# Altium schematic sheet Schemathic_IV-11_Clock.SchDoc
size A3; SheetNumber: 1; SheetTotal: 1; SPICEModelCacheXETPOSJP: <root> / <DocumentId>XETPOSJP</DocumentId> / </root>
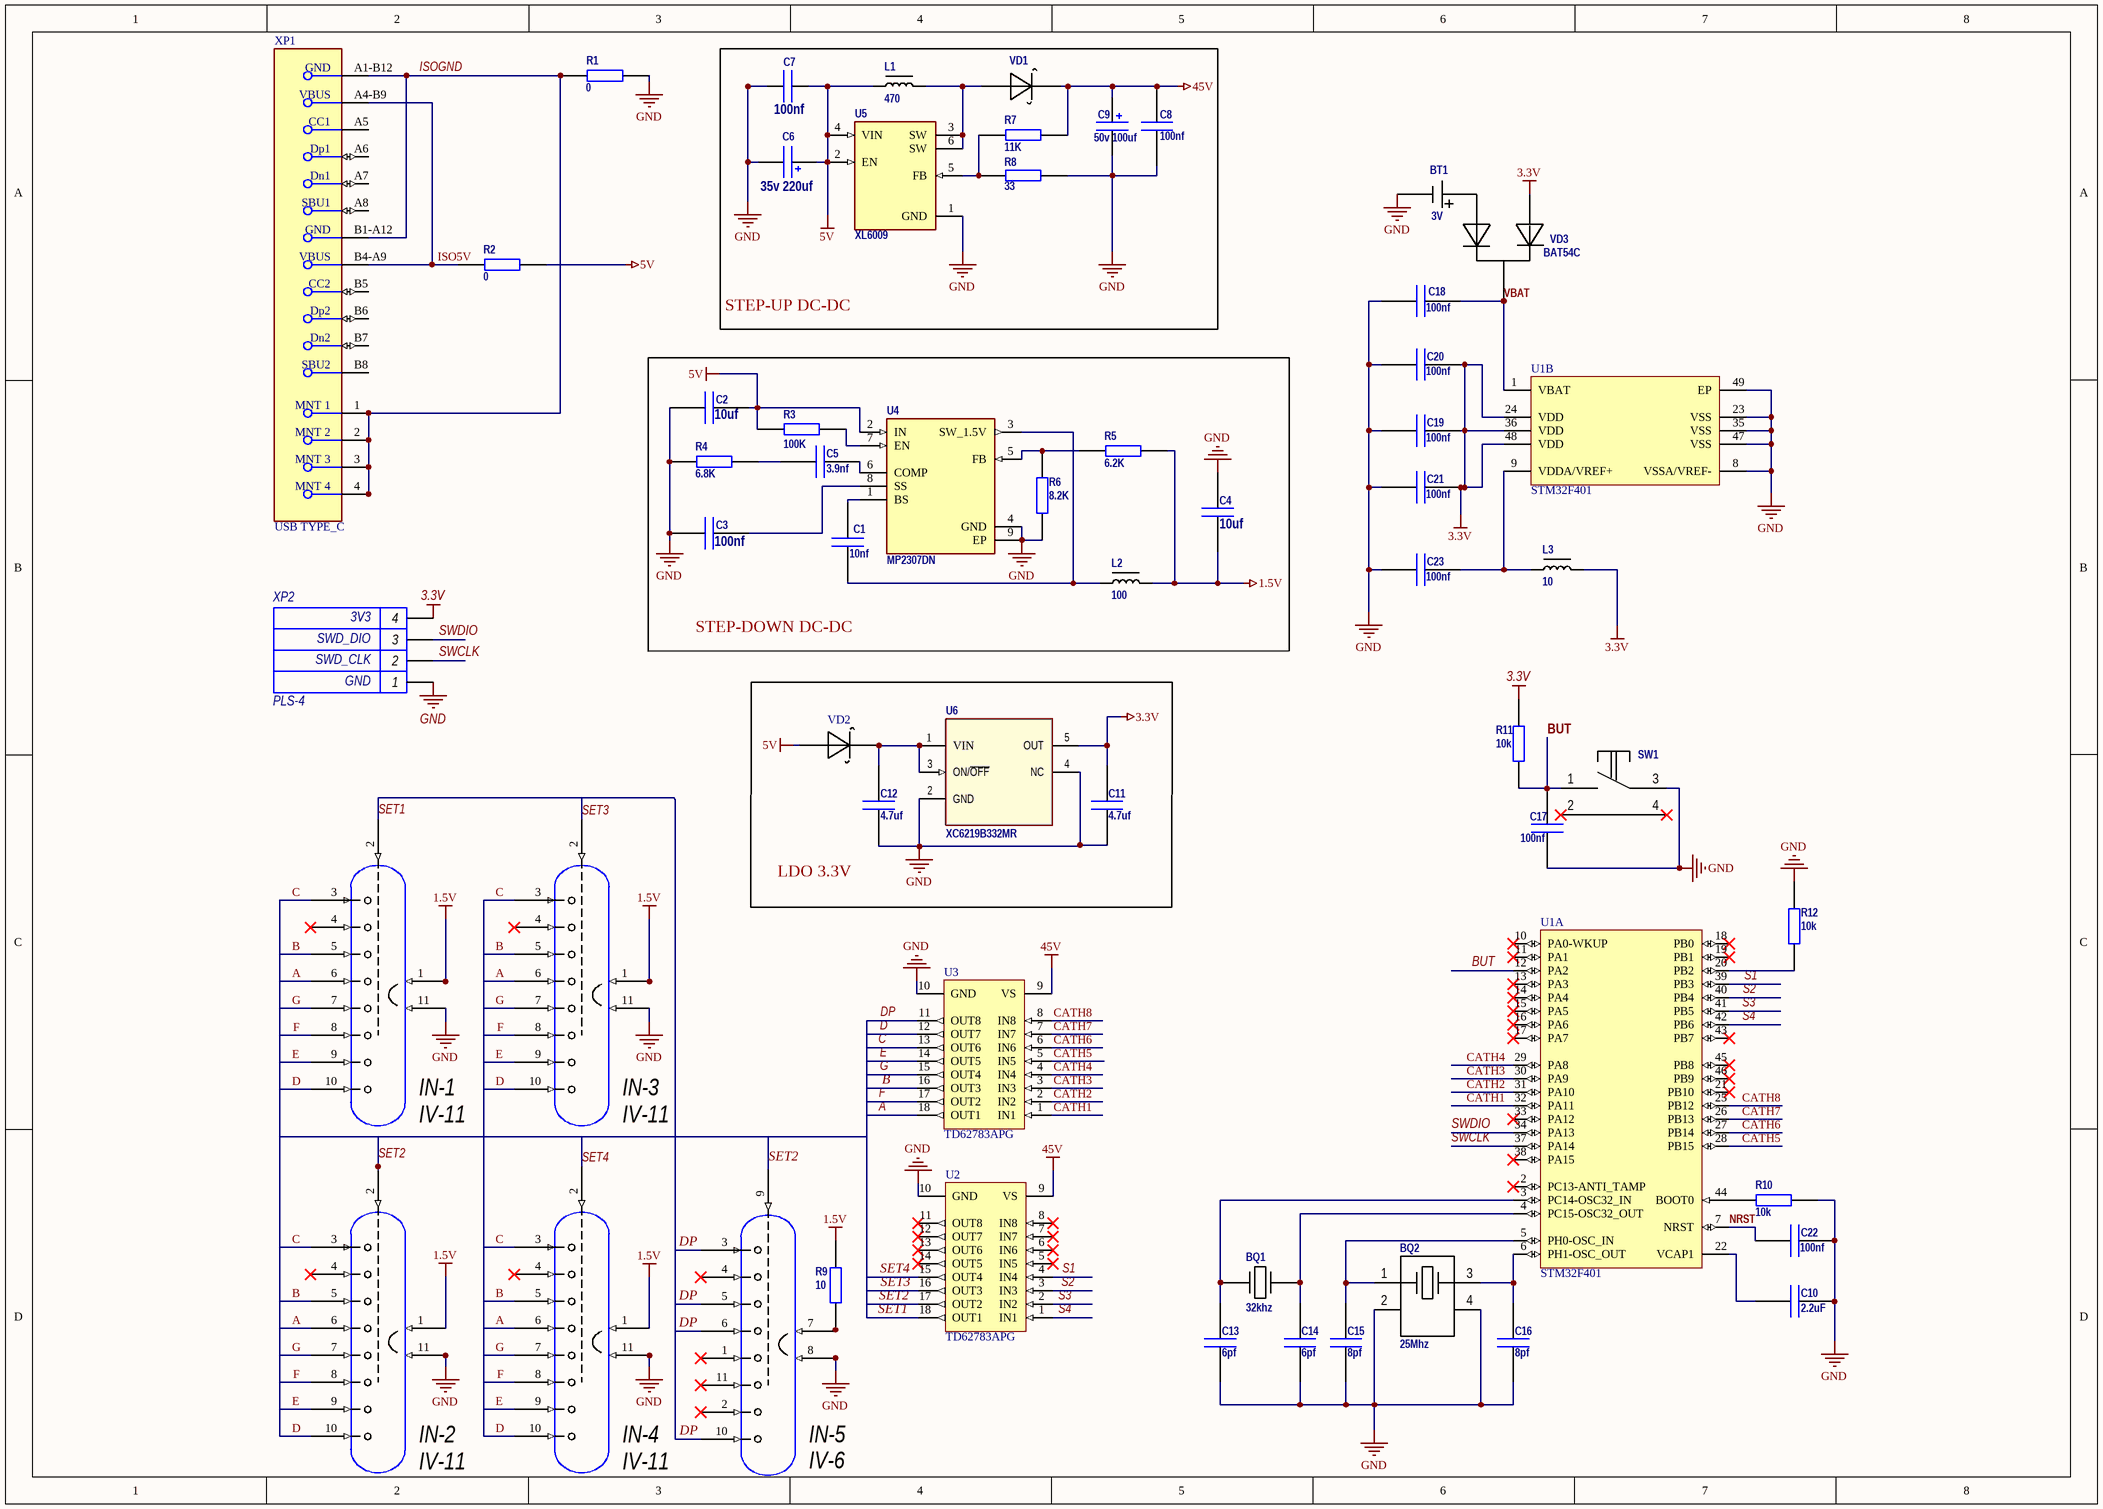
[diagram p0: Schemathic_IV-11_Clock.SchDoc]

## Parts
BQ1  32khz  [KX-327NHT]
BQ2  25Mhz  [4-SMD No lead]
BT1  value 3V  [Battery_2032]  (hidden comment: CR2032)
C1  10nf  [Cap_0603]
C2  10uf  [Cap_1206_3216]
C3  100nf  [Cap_0603]
C4  10uf  [Cap_1206_3216]
C5  3.9nf  [Cap_0603]
C6  35v 220uf  [CAP 6.6MM H5.4MM]
C7  100nf  [Cap_0603]
C8  100nf  [Cap_0603]
C9  value 50v 100uf  [CAP 6.6MM H5.4MM]  (hidden comment: 100uf)
C10  2.2uF  [Cap_0402]
C11  4.7uf  [Cap_0402]
C12  4.7uf  [Cap_0402]
C13  6pf  [Cap_0402]
C14  6pf  [Cap_0402]
C15  8pf  [Cap_0402]
C16  8pf  [Cap_0402]
C17  100nf  [Cap_0402]
C18  100nf  [Cap_0402]
C19  100nf  [Cap_0402]
C20  100nf  [Cap_0402]
C21  100nf  [Cap_0402]
C22  100nf  [Cap_0402]
C23  100nf  [Cap_0402]
IN-1  IV-11  [PCBComponent_1]
IN-2  IV-11  [PCBComponent_1]
IN-3  IV-11  [PCBComponent_1]
IN-4  IV-11  [PCBComponent_1]
IN-5  IV-6  [PCBComponent_1]
L1  470  [CDRH127NP]
L2  100  [3232_8.89 mm]
L3  10  [FER 0603]
R1  0  [Res_1206]
R2  0  [Res_1206]
R3  100K  [RES_0603]
R4  6.8K  [RES_0603]
R5  value 6.2K  [RES_0603]  (hidden comment: 5.1K)
R6  8.2K  [RES_0603]
R7  11K  [RES_0603]
R8  33  [RES_0603]
R9  10  [DIP]
R10  10k  [Res_0201]
R11  10K  [Res_0201]
R12  10k  [Res_0201]
SW1  Switch Right Angle  [Button Right Angle]  (value not drawn)
U1  STM32F401  [STM-UFQFPN48_N]  (parts A,B of 2)
U2  TD62783APG  [ALEG-DIP-18]
U3  TD62783APG  [ALEG-DIP-18]
U4  MP2307DN  [SOIC127P600X170-9N]
U5  XL6009  [DPAK170P1435X465-6N]
U6  XC6219B332MR  [SOT-23-5]
VD1  SS34  [SMA_DO214AC]  (value not drawn)
VD2  BAS321  [SOD323]  (value not drawn)
VD3  BAT54C  [SOT-23-3]
XP1  USB TYPE_C  [FP-USB4105-GF-A-MFG]
XP2  PLS-4  [PLS-4]

## Blocks framed on the sheet
STEP-UP DC-DC: C6-C9 L1 R7 R8 U5 VD1
STEP-DOWN DC-DC: C1-C5 L2 R3-R6 U4
LDO 3.3V: C11 C12 U6 VD2

## Nets
1.5V: C4.2 IN-1.1 IN-2.1 IN-3.1 IN-4.1 L2.2 R5.1 R9.2
3.3V: C11.1 C19.1 C20.1 C21.2 L3.1 R11.2 U1.24(VDD) U1.36(VDD) U1.48(VDD) U6.5(OUT) VD3.1 XP2.4
5V: C2.1 C6.1 C7.1 L1.1 R2.2 R3.2 U4.2(IN) U5.2(EN) U5.4(VIN) VD2.1
45V: C8.1 C9.1 R7.2 U2.9(VS) U3.9(VS) VD1.2
GND: BQ2.2(GND) BQ2.4(GND) BT1.2(-) C2.2 C3.1 C4.1 C6.2 C7.2 C8.2 C9.2 C10.2 C11.2 C12.2 C13.1 C14.1 C15.1 C16.1 C17.1 C18.1 C19.2 C20.2 C21.1 C22.2 C23.2 IN-1.11 IN-2.11 IN-3.11 IN-4.11 IN-5.8 R1.2 R4.2 R6.2 R8.2 R10.1 R12.2 SW1.3 U1.8(VSSA/VREF-) U1.23(VSS) U1.35(VSS) U1.47(VSS) U1.49(EP) U2.10(GND) U3.10(GND) U4.4(GND) U4.9(EP) U5.1(GND) U6.2(GND) U6.4(NC) XP2.1
A: IN-1.6 IN-2.6 IN-3.6 IN-4.6 U3.18(OUT1)
B: IN-1.5 IN-2.5 IN-3.5 IN-4.5 U3.16(OUT3)
BUT: C17.2 R11.1 SW1.1 U1.12(PA2)
C: IN-1.3 IN-2.3 IN-3.3 IN-4.3 U3.13(OUT6)
CATH1: U1.32(PA11) U3.1(IN1)
CATH2: U1.31(PA10) U3.2(IN2)
CATH3: U1.30(PA9) U3.3(IN3)
CATH4: U1.29(PA8) U3.4(IN4)
CATH5: U1.28(PB15) U3.5(IN5)
CATH6: U1.27(PB14) U3.6(IN6)
CATH7: U1.26(PB13) U3.7(IN7)
CATH8: U1.25(PB12) U3.8(IN8)
D: IN-1.10 IN-2.10 IN-3.10 IN-4.10 U3.12(OUT7)
DP: IN-5.3 IN-5.5 IN-5.6 IN-5.10 U3.11(OUT8)
E: IN-1.9 IN-2.9 IN-3.9 IN-4.9 U3.14(OUT5)
F: IN-1.8 IN-2.8 IN-3.8 IN-4.8 U3.17(OUT2)
G: IN-1.7 IN-2.7 IN-3.7 IN-4.7 U3.15(OUT4)
ISO5V: R2.1 XP1.A4-B9(VBUS) XP1.B4-A9(VBUS)
ISOGND: R1.1 XP1.1(MNT_1) XP1.2(MNT_2) XP1.3(MNT_3) XP1.4(MNT_4) XP1.A1-B12(GND) XP1.B1-A12(GND)
NRST: C22.1 U1.7(NRST)
S1: U1.39(PB3) U2.4(IN4)
S2: U1.40(PB4) U2.3(IN3)
S3: U1.41(PB5) U2.2(IN2)
S4: U1.42(PB6) U2.1(IN1)
SET1: IN-1.2 U2.18(OUT1)
SET2: IN-2.2 IN-5.9 U2.17(OUT2)
SET3: IN-3.2 U2.16(OUT3)
SET4: IN-4.2 U2.15(OUT4)
SWCLK: U1.37(PA14) XP2.2
SWDIO: U1.34(PA13) XP2.3
VBAT: C18.2 U1.1(VBAT) VD3.3
NetBQ1_1: BQ1.1(OSC1) C13.2 U1.3(PC14-OSC32_IN)
NetBQ1_2: BQ1.2(OSC2) C14.2 U1.4(PC15-OSC32_OUT)
NetBQ2_1: BQ2.1(OSC1) C15.2 U1.5(PH0-OSC_IN)
NetBQ2_3: BQ2.3(OSC2) C16.2 U1.6(PH1-OSC_OUT)
NetBT1_1: BT1.1(+) VD3.2
NetC1_1: C1.1 L2.1 U4.3(SW_1.5V)
NetC1_2: C1.2 U4.1(BS)
NetC3_2: C3.2 U4.8(SS)
NetC5_1: C5.1 U4.6(COMP)
NetC5_2: C5.2 R4.1
NetC10_1: C10.1 U1.22(VCAP1)
NetC12_1: C12.1 U6.1(VIN) U6.3(ON/~{OFF}) VD2.2
NetC23_1: C23.1 L3.2 U1.9(VDDA/VREF+)
NetIN-5_7: IN-5.7 R9.1
NetL1_2: L1.2 U5.3(SW) U5.6(SW) VD1.1
NetR3_1: R3.1 U4.7(EN)
NetR5_2: R5.2 R6.1 U4.5(FB)
NetR7_1: R7.1 R8.1 U5.5(FB)
NetR10_2: R10.2 U1.44(BOOT0)
NetR12_1: R12.1 U1.20(PB2)

Not connected (* = marked no-connect by the designer): IN-1 4*; IN-2 4*; IN-3 4*; IN-4 4*; IN-5 1* 2* 4* 11*; SW1 2* 4*; U1 2(PC13-ANTI_TAMP)* 10(PA0-WKUP)* 11(PA1)* 13(PA3)* 14(PA4)* 15(PA5)* 16(PA6)* 17(PA7)* 18(PB0)* 19(PB1)* 21(PB10)* 33(PA12)* 38(PA15)* 43(PB7)* 45(PB8)* 46(PB9)*; U2 5(IN5)* 6(IN6)* 7(IN7)* 8(IN8)* 11(OUT8)* 12(OUT7)* 13(OUT6)* 14(OUT5)*; XP1 A5(CC1) A6(Dp1) A7(Dn1) A8(SBU1) B5(CC2) B6(Dp2) B7(Dn2) B8(SBU2)

## Notes on the sheet
- (near XP2) SWD_DIO
- (near XP2) 3V3
- (near XP2) GND
- (near XP2) SWD_CLK

## Library data of the parts
BQ1 = XTAL-2Pin: Часовой кварц; Package: DIP; Value: 32khz
BQ2 = XTAL-4Pin_1: Кварцевый резонатор; Package: DIP; Value: 25Mhz
BT1 = Battery_2Pin: Держатель  для CR2032; Name: держатель для CR2032
C1-C5 C7 C8 C10-C23 = Capacitor: Конденсатор; Package: 0805
  C2 C4: Value: 10uf
  C3 C7 C8 C17-C23: Value: 100nf
  C5: Value: 3.9nf
  C10: Value: 2.2uF
  C11 C12: Value: 4.7uf
  C13 C14: Value: 6pf
  C15 C16: Value: 8pf
C6 C9 = Capacitor_Polar: Конденсатор эл-лит; Package: DIP
  C6: Value: 35v 220uf
IN-1-IN-5 = IV-11: Вакуумный индикатор
L1-L3 = Drossel: Дроссель
  L1: Value: 470
  L2: Value: 100
  L3: Value: 10
R1-R12 = Resistor: Резистор; Package: 0805
  R1 R2: Value: 0
  R3: Value: 100K
  R4: Value: 6.8K
  R6: Value: 8.2K
  R7: Value: 11K
  R8: Value: 33
  R9: Value: 10
  R10-R12: Value: 10k
SW1 = Button: Кнопка; Packege: DIP; Value: TS-A3PS-130
U1 = CMP-0243-00119-2: ARM Cortex-M4 32-bit MCU+FPU, 105 DMIPS, 256 kB Flash, 64 kB Internal RAM, 36 I/Os, 48-pin UFQFPN, -40 to 85 degC, Tray; Manufacturer: STMicroelectronics; PartNumber: STM32F401CCU6; Supply Voltage(Vcc) max (V): 3.6; I/Os (High Current): 36; Internal RAM Size (kB): 64; Operating Frequency(F) (Processor speed) (MHz): 84; FLASH Size (Prog) (kB): 256; Supply Voltage(Vcc) min (V): 1.8; Packing: Tray; PackageReference: UFQFPN48; PackageVersion: Rev. 1, 04/2013; Core: ARM Cortex-M4; ComponentLink1Description: Manufacturer URL; ComponentLink3Description: Package Specification; PackageDescription: 48-Pin Ultra Thin Fine Pitch Quad Flat No-Lead, 7 x 7 x 0.6 mm Body, 0.5 mm Pitch, Exposed Pad; Mounting Technology: Surface Mount; ComponentLink2URL: http://www.st.com/st-web-ui/static/active/en/resource/technical/document/data_brief/DM00071938.pdf; DatasheetVersion: Rev. 1; ComponentLink2Description: Datasheet; ComponentLink1URL: http://www.st.com/web/en/home.html; ComponentLink3URL: http://www.st.com/st-web-ui/static/active/en/resource/technical/document/data_brief/DM00071938.pdf
U2 U3 = CMP-2000-07346-1: 8-Channel Source Driver, 15 V Input, -20 to 85 degC, 18-Pin DIP, RoHS, Tube; Manufacturer: Allegro Microsystems; Number of Outputs: 8; Current - Output / Channel: 120mA; Other Names: 620-1120; Input Type: Non-Inverting; Current - Peak Output: 500mA; Voltage - Supply: 25V; Product Change Notification: UDN298xAx-TLTBNotice30/Apr/2012; Mounting Type: ThroughHole; Type: HighSide; Mounting Technology: ThroughHole; Package Description: 18-Pin Double In-line Package, Body 22.86 x 6.605 mm, Pitch 2.54 mm; Category: IntegratedCircuits(ICs); Standard Package: 21; On-State Resistance: -; Package / Case: 18-DIP(0.300",7.62mm); Operating Temperature: -20°C~85°C; Datasheet URL: https://datasheet.ciiva.com/19456/1762681-19456617.pdf; Supplier Device Package: 18-DIP; Package Reference: DIP-18; Series: -; Family: PMIC-MOSFET,BridgeDrivers-InternalSwitch; Packaging: Tube; Manufacturer URL: http://www.allegromicro.com/
U4 = MP2307DN-LF-Z: Buck Switching Regulator IC Positive Adjustable 0.925V 1 Output 3A 8-SOIC (0.154, 3.90mm Width) Exposed Pad; MF: Monolithic Power; Check_prices: https://www.snapeda.com/parts/MP2307DN-LF-Z/Monolithic+Power+Systems+Inc./view-part/?ref=eda; SnapEDA_Link: https://www.snapeda.com/parts/MP2307DN-LF-Z/Monolithic+Power+Systems+Inc./view-part/?ref=snap; Availability: In Stock; Value: *; Price: None; MP: MP2307DN-LF-Z; Package: SOIC-8 Monolithic Power; Purchase-URL: https://pricing.snapeda.com/search/part/MP2307DN-LF-Z/?ref=eda
U5 = XL6009: The XL6009 regulator is a wide input range, current mode, DC/DC converter which is capable of generating either positive or negative output voltages.; MF: XLSEMI; Package: TO-263-5L XLSEMI; Price: None; Value: *; SnapEDA_Link: https://www.snapeda.com/parts/XL6009/XLSEMI/view-part/?ref=snap; MP: XL6009; Availability: Not in stock; Check_prices: https://www.snapeda.com/parts/XL6009/XLSEMI/view-part/?ref=eda
U6 = LD2980ABM33TR: LDO; Package: T05A; Value: LD2980ABM33TR; Name: XC6219B332MR
VD1 VD2 = Diode Shotki: Диод Шотки; Value: 10BQ100
VD3 = Diode_Double: Диод; Name: BAT54C
XP1 = CMP-245163-000001-1: CONN RCPT USB2.0 TYPEC 5A; Manufacturer Part Number: USB4105-GF-A; Manufacturer: GCT; Voltage Rating: 20V; Is Female: yes; Current Rating: 5/6.25/1.25/0.25A; Number Of Contacts: 16; Conn Orientation: Right Angle; Device Class L1: Connectors; Category: Conn; Lead Free: Yes; RoHS: TRUE; Temperature Range High: +85°C; Digikey Description: CONN RCPT USB2.0 TYPEC 5A; Device Class L3: unset; ComponentLink2Description: Datasheet; Package: 0; Usb Standard: USB 2.0; Device Class L2: USB Connectors; Automotive: No; Temperature Range Low: -40°C; Height: 3.46mm; Temperature: -40°C to +85°C; Contact Material: Gold,Nickel; ComponentLink2URL: https://gct.co/files/drawings/usb4105.pdf; Octopart: https://octopart.com/usb4105-gf-a-gct-106627878
XP2 = XP4: Connector